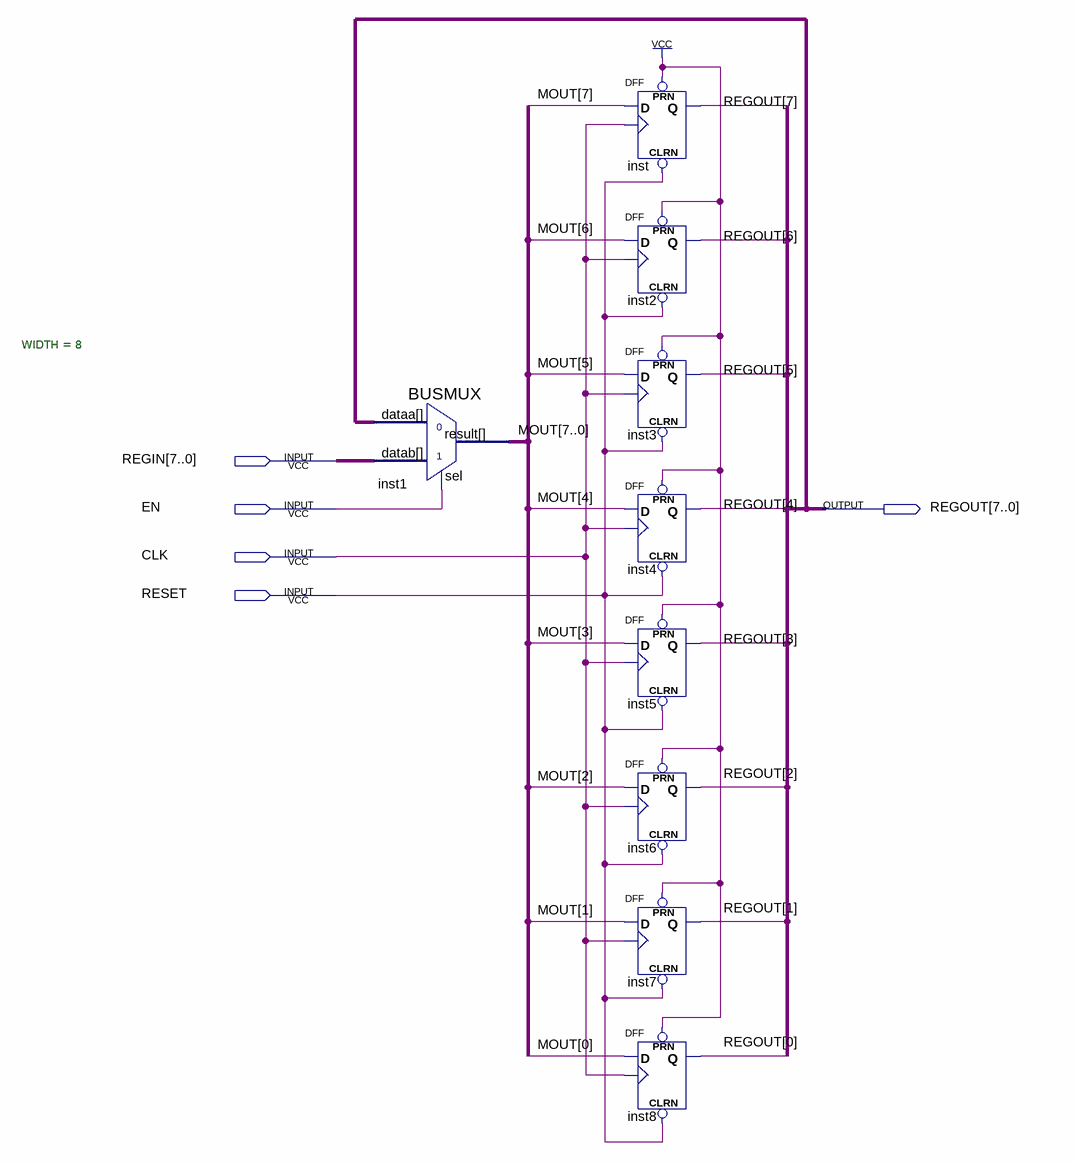
[diagram p0: schematic sheet]
// Quartus schematic Register8Bits.bdf as structural Verilog: 9 symbols, 5 pins
module Register8Bits (
  input  [7:0] REGIN,
  input  EN,
  input  CLK,
  input  RESET,
  output [7:0] REGOUT
);

  wire [7:0] MOUT;

  BUSMUX #(.WIDTH(8)) inst1 (.datab(REGIN), .sel(EN), .dataa(REGOUT), .result(MOUT));
  DFF inst (.CLRN(RESET), .CLK(CLK), .D(MOUT[7]), .PRN(1'b1), .Q(REGOUT[7]));
  DFF inst2 (.CLRN(RESET), .CLK(CLK), .D(MOUT[6]), .PRN(1'b1), .Q(REGOUT[6]));
  DFF inst3 (.CLRN(RESET), .CLK(CLK), .D(MOUT[5]), .PRN(1'b1), .Q(REGOUT[5]));
  DFF inst4 (.CLRN(RESET), .CLK(CLK), .D(MOUT[4]), .PRN(1'b1), .Q(REGOUT[4]));
  DFF inst5 (.CLRN(RESET), .CLK(CLK), .D(MOUT[3]), .PRN(1'b1), .Q(REGOUT[3]));
  DFF inst6 (.CLRN(RESET), .CLK(CLK), .D(MOUT[2]), .PRN(1'b1), .Q(REGOUT[2]));
  DFF inst7 (.CLRN(RESET), .CLK(CLK), .D(MOUT[1]), .PRN(1'b1), .Q(REGOUT[1]));
  DFF inst8 (.CLRN(RESET), .CLK(CLK), .D(MOUT[0]), .PRN(1'b1), .Q(REGOUT[0]));
endmodule
